# Altium schematic sheet OutputConnectors.SchDoc
size Letter; CompanyName: Ploopy Corporation; Organization: Ploopy Corporation; Address1: Suite 226, 137-1140 Burnhamthorpe Road W; Address2: Mississauga; Address3: Ontario; Address4: Canada L5C 0A3; DocumentNumber: 9; Revision: R1.007; SheetNumber: 9; SheetTotal: 11
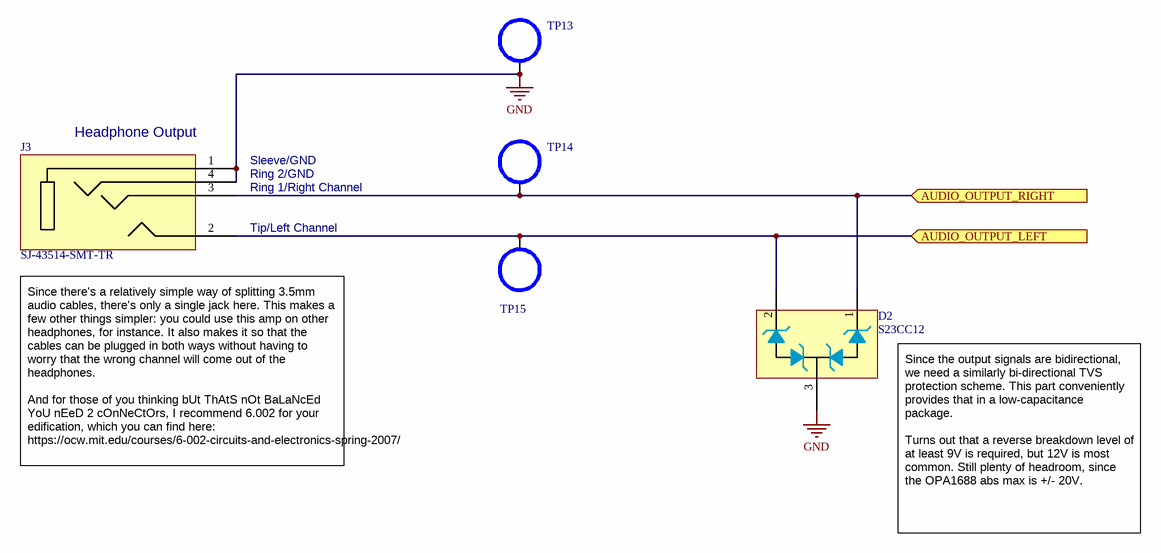
[diagram p0: OutputConnectors.SchDoc]

## Parts
D2  S23CC12  [S23CC12 - SOT90P240X110-3M]
J3  SJ-43514-SMT-TR  [SJ-43514-SMT-TR]
TP13  TestPointHook  [S2751-46R]  (value not drawn)
TP14  TestPointHook  [S2751-46R]  (value not drawn)
TP15  TestPointHook  [S2751-46R]  (value not drawn)

## Ports
AUDIO_OUTPUT_LEFT (in), AUDIO_OUTPUT_RIGHT (in)

## Nets
GND: D2.3 J3.1 J3.4 TP13.1
AUDIO_OUTPUT_LEFT: D2.2 J3.2 TP15.1 ; port AUDIO_OUTPUT_LEFT
AUDIO_OUTPUT_RIGHT: D2.1 J3.3 TP14.1 ; port AUDIO_OUTPUT_RIGHT

## Notes on the sheet
- (near J3) Headphone Output
- Sleeve/GND
- Ring 2/GND
- Ring 1/Right Channel
- Tip/Left Channel
- (near J3) Since there's a relatively simple way of splitting 3.5mm audio cables, there's only a single jack here. This makes a few other things simpler: you could use this amp on other headphones, for instance. It also makes it so that the cables can be plugged in both ways without having to worry that the wrong channel will come out of the headphones.
  And for those of you thinking bUt ThAtS nOt BaLaNcEd YoU nEeD 2 cOnNeCtOrs, I recommend 6.002 for your edification, which you can find here: https://ocw.mit.edu/courses/6-002-circuits-and-electronics-spring-2007/
- (near D2) Since the output signals are bidirectional, we need a similarly bi-directional TVS protection scheme. This part conveniently provides that in a low-capacitance package.
  Turns out that a reverse breakdown level of at least 9V is required, but 12V is most common. Still plenty of headroom, since the OPA1688 abs max is +/- 20V.
- Copyright Ploopy Corporation 2023
- Licensed under the CERN-OHL-S v2
- http://ohwr.org/cernohl
- Title:
- PCB:
- Version:
- Ploopy Corporation
- Mississauga ON L5C 0A3
- 137-1140 Burnhamthorpe Road W
- Date:
- Time:
- Sheet
- of
- Canada

## Library data of the parts
D2 = S23CC12: 12V 2-CHANNEL LOW CAPACITANCE BI-DIRECTIONAL TVS ARRAY
J3 = SJ-43514-SMT-TR: 3.50mm (0.141", 1/8", Mini Plug) - Headphone Phone Jack Stereo (4 Conductor, TRRS) Connector Solder; Supplier 1: Digi-Key; Supplier 2: Mouser; Supplier Part Number 2: 490-SJ-43514-SMT-TR; Supplier Part Number 1: CP-43514SJCT-ND
TP13-TP15 = TestPointHook: Test point, SMT ring (micro-hook compatible); Supplier 1: Digi-Key; Supplier Part Number 1: 952-2664-6-ND; Supplier 2: Digi-Key; Supplier Part Number 2: A106144DKR-ND; Supplier 3: Arrow; Supplier Part Number 3: z_4zPAhGJpPHHYBcC24zmONEz5elv0VZALWfNkICq0w